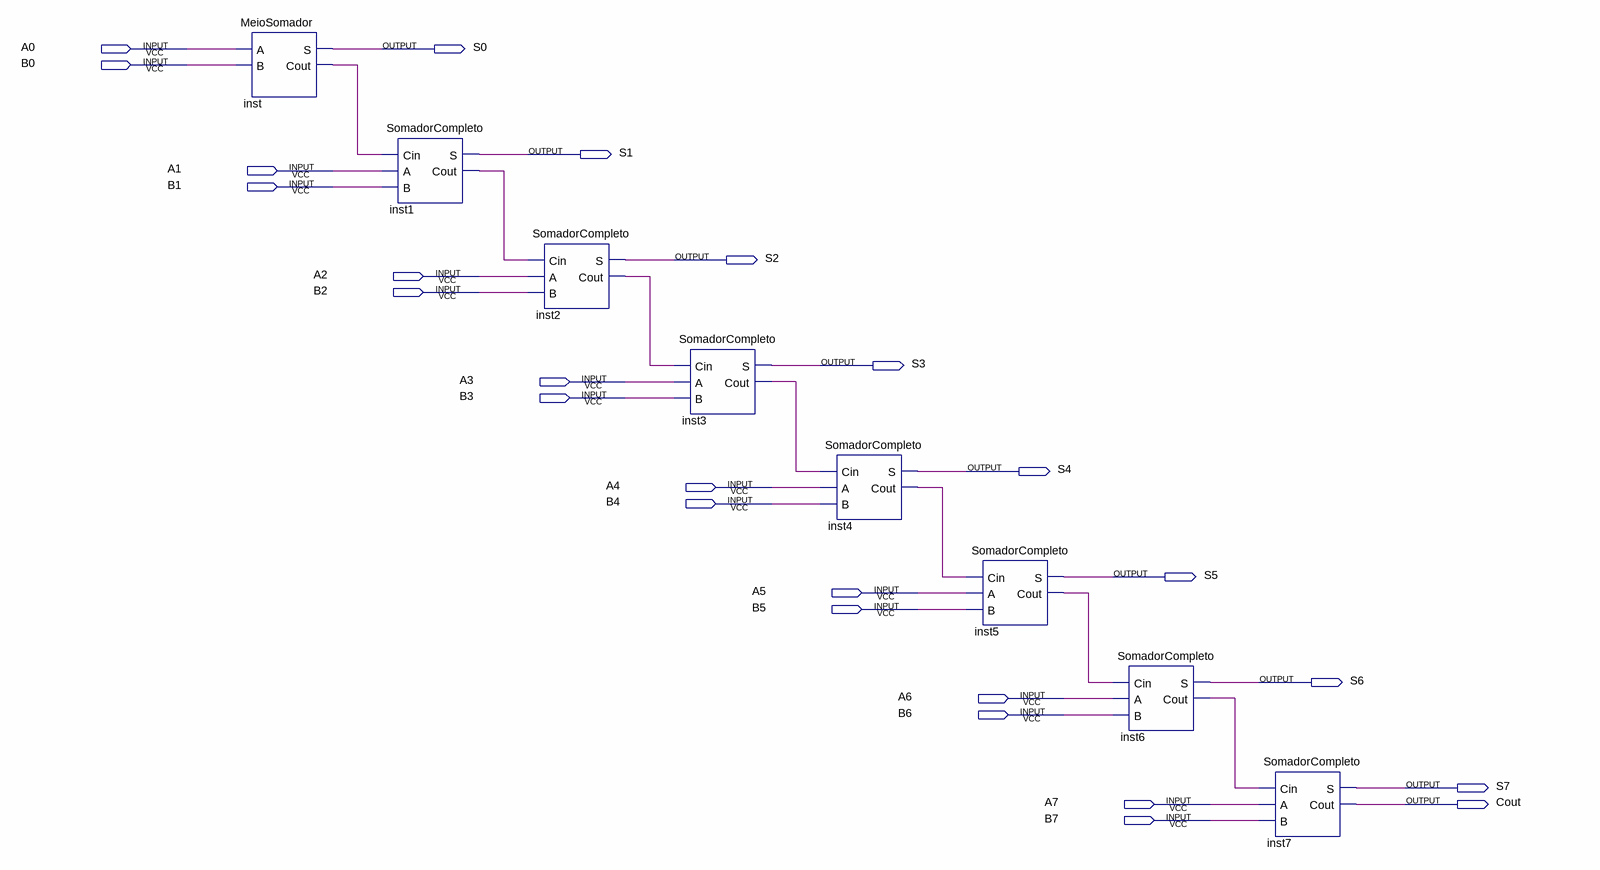
[diagram p0: schematic sheet]
// Quartus schematic SomadorDe8Bits.bdf as structural Verilog: 8 symbols, 25 pins
module SomadorDe8Bits (
  input  A0,
  input  B0,
  input  A1,
  input  B1,
  input  A2,
  input  B2,
  input  A3,
  input  B3,
  input  A4,
  input  B4,
  input  A5,
  input  B5,
  input  A6,
  input  B6,
  input  A7,
  input  B7,
  output S0,
  output S1,
  output S2,
  output S3,
  output S4,
  output S5,
  output S6,
  output S7,
  output Cout
);

  wire inst1_cout, inst2_cout, inst3_cout, inst4_cout, inst5_cout, inst6_cout, inst_cout;

  MeioSomador inst (.A(A0), .B(B0), .S(S0), .Cout(inst_cout));
  SomadorCompleto inst1 (.Cin(inst_cout), .A(A1), .B(B1), .S(S1), .Cout(inst1_cout));
  SomadorCompleto inst2 (.Cin(inst1_cout), .A(A2), .B(B2), .S(S2), .Cout(inst2_cout));
  SomadorCompleto inst3 (.Cin(inst2_cout), .A(A3), .B(B3), .S(S3), .Cout(inst3_cout));
  SomadorCompleto inst4 (.Cin(inst3_cout), .A(A4), .B(B4), .S(S4), .Cout(inst4_cout));
  SomadorCompleto inst5 (.Cin(inst4_cout), .A(A5), .B(B5), .S(S5), .Cout(inst5_cout));
  SomadorCompleto inst6 (.Cin(inst5_cout), .A(A6), .B(B6), .S(S6), .Cout(inst6_cout));
  SomadorCompleto inst7 (.Cin(inst6_cout), .A(A7), .B(B7), .S(S7), .Cout(Cout));
endmodule
